# Altium schematic sheet Signal_conditioning.SchDoc
size A4; SheetNumber: 3; SheetTotal: 3
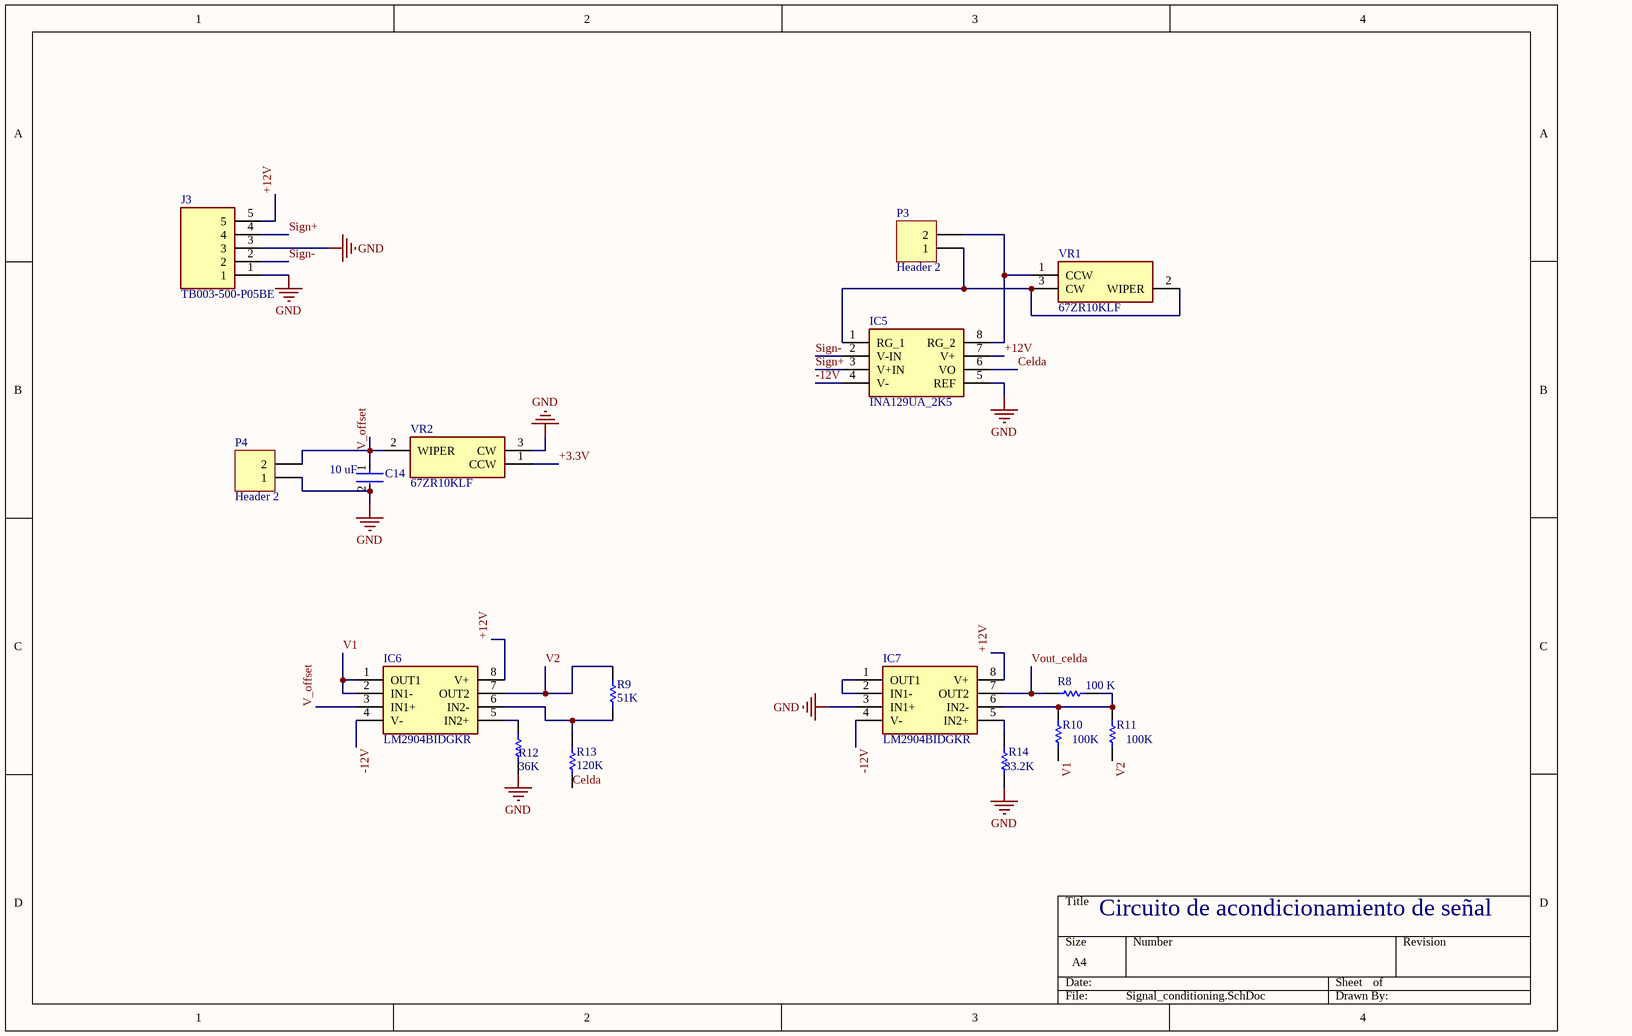
[diagram p0: Signal_conditioning.SchDoc]

## Parts
C14  10 uF  [FP-GRM188-0_1-e0_2_0_55-MFG]
IC5  INA129UA_2K5  [SOIC127P600X175-8N]
IC6  LM2904BIDGKR  [SOP65P490X110-8N]
IC7  LM2904BIDGKR  [SOP65P490X110-8N]
J3  TB003-500-P05BE  [TB003500P05BE]
P3  Header 2  [HDR1X2]
P4  Header 2  [HDR1X2]
R8  100 K  [RESC1608X55X30NL15T15]
R9  51K  [RESC1608X55X30ML20T20]
R10  100K  [RESC1608X55X30NL15T15]
R11  100K  [RESC1608X55X30NL15T15]
R12  36K  [RESC1608X55X30ML20T20]
R13  120K  [RESC1608X55X30ML20T20]
R14  33.2K  [RESC1608X55X30NL15T15]
VR1  67ZR10KLF  [67ZR10KLF]
VR2  67ZR10KLF  [67ZR10KLF]

## Nets
GND: C14.2 IC5.5(REF) IC7.3(IN1+) J3.1 J3.3 P4.1 R12.1 R14.1 VR2.3(CW)
+3.3V: VR2.1(CCW)
+12V: IC5.7(V+) IC6.8(V+) IC7.8(V+) J3.5
-12V: IC5.4(V-) IC6.4(V-) IC7.4(V-)
Celda: IC5.6(VO) R13.1
Sign+: IC5.3(V+IN) J3.4
Sign-: IC5.2(V-IN) J3.2
V1: IC6.1(OUT1) IC6.2(IN1-) R10.1
V2: IC6.7(OUT2) R9.2 R11.1
V_offset: C14.1 IC6.3(IN1+) P4.2 VR2.2(WIPER)
Vout_celda: IC7.7(OUT2) R8.2
NetIC5_1: IC5.1(RG_1) P3.1 VR1.2(WIPER) VR1.3(CW)
NetIC5_8: IC5.8(RG_2) P3.2 VR1.1(CCW)
NetIC6_5: IC6.5(IN2+) R12.2
NetIC6_6: IC6.6(IN2-) R9.1 R13.2
NetIC7_1: IC7.1(OUT1) IC7.2(IN1-)
NetIC7_5: IC7.5(IN2+) R14.2
NetIC7_6: IC7.6(IN2-) R8.1 R10.2 R11.2

## Notes on the sheet
- Circuito de acondicionamiento de señal

## Library data of the parts
C14 = CMP-2006-02759-2: Chip Multilayer Ceramic Capacitors for General Purpose, 0603, 10uF, X6S, 22%, 20%, 2.5V; Voltage Rating (DC): 2.5V; Package Quantity: 4000; Tolerance: 20%; Mount: Surface Mount; Height: 0.8mm; Voltage: 2.5V; Packaging: Tape and Reel; Thickness: 0.035inch; Case/Package: 0603; Max Operating Temperature: 105°C; Termination: SMD/SMT; Depth: 0.8mm; Case Code (Metric): 1608; Dielectric: X6S; Capacitance: 10uF; Voltage Rating: 2.5V; Width: 0.031inch; Radiation Hardening: No; Case Code (Imperial): 0603; REACH SVHC: No SVHC; Min Operating Temperature: -55°C; Length: 1.6mm
IC5 = INA129UA_2K5: Integrated Circuit; Manufacturer_Name: Texas Instruments; Manufacturer_Part_Number: INA129UA/2K5; Datasheet Link: http://www.ti.com/lit/gpn/INA129; Height: 1.75mm; Mouser Part Number: 595-INA129UA/2K5; Mouser Price/Stock: https://www.mouser.co.uk/ProductDetail/Texas-Instruments/INA129UA-2K5?qs=VBduBm9rCJTU2wXJjO5FZQ%3D%3D; Arrow Part Number: INA129UA/2K5; Arrow Price/Stock: https://www.arrow.com/en/products/ina129ua2k5/texas-instruments?region=nac
IC6 IC7 = LM2904BIDGKR: Integrated Circuit; Manufacturer_Name: Texas Instruments; Datasheet Link: https://pdf1.alldatasheet.com/ce52a4c4-aa79-4bf9-a931-b119e42401bc; Height: 1.1mm; Manufacturer_Part_Number: LM2904BIDGKR; Mouser Part Number: 595-LM2904BIDGKR; Mouser Price/Stock: https://www.mouser.co.uk/ProductDetail/Texas-Instruments/LM2904BIDGKR?qs=DRkmTr78QASPPFtqyAg2uA%3D%3D; Arrow Part Number: LM2904BIDGKR; Arrow Price/Stock: https://www.arrow.com/en/products/lm2904bidgkr/texas-instruments?region=nac
J3 = TB003-500-P05BE: Connector; Manufacturer_Name: CUI Devices; Datasheet Link: https://www.cui.com/product/resource/tb003-500.pdf; Height: 10.7mm; Manufacturer_Part_Number: TB003-500-P05BE; Mouser Part Number: 490-TB003-500-P05BE; Mouser Price/Stock: https://www.mouser.co.uk/ProductDetail/CUI-Devices/TB003-500-P05BE?qs=vLWxofP3U2xXm4XKOMROaw%3D%3D; Arrow Part Number: TB003-500-P05BE; Arrow Price/Stock: https://www.arrow.com/en/products/tb003-500-p05be/cui-devices?region=nac
P3 P4 = Header 2: Header, 2-Pin; LatestRevisionDate: 17-Jul-2002; LatestRevisionNote: Re-released for DXP Platform.; Publisher: Altium Limited
R8 R10 R11 R14 = CMP-2000-00705-1: Manufacturer: Panasonic; Part Number: ERJ-3GEYJ104V
R9 R12 R13 = CMP-2000-00041-1: Part Number: ERA3AEB333V; Manufacturer: Panasonic
VR1 VR2 = 67ZR10KLF: Variable Resistor; Manufacturer_Name: TT Electronics; Datasheet Link: https://componentsearchengine.com/Datasheets/1/67ZR10KLF.pdf; Height: 10.4mm; Manufacturer_Part_Number: 67ZR10KLF; Mouser Part Number: 858-67ZR10KLF; Mouser Price/Stock: https://www.mouser.com/Search/Refine.aspx?Keyword=858-67ZR10KLF